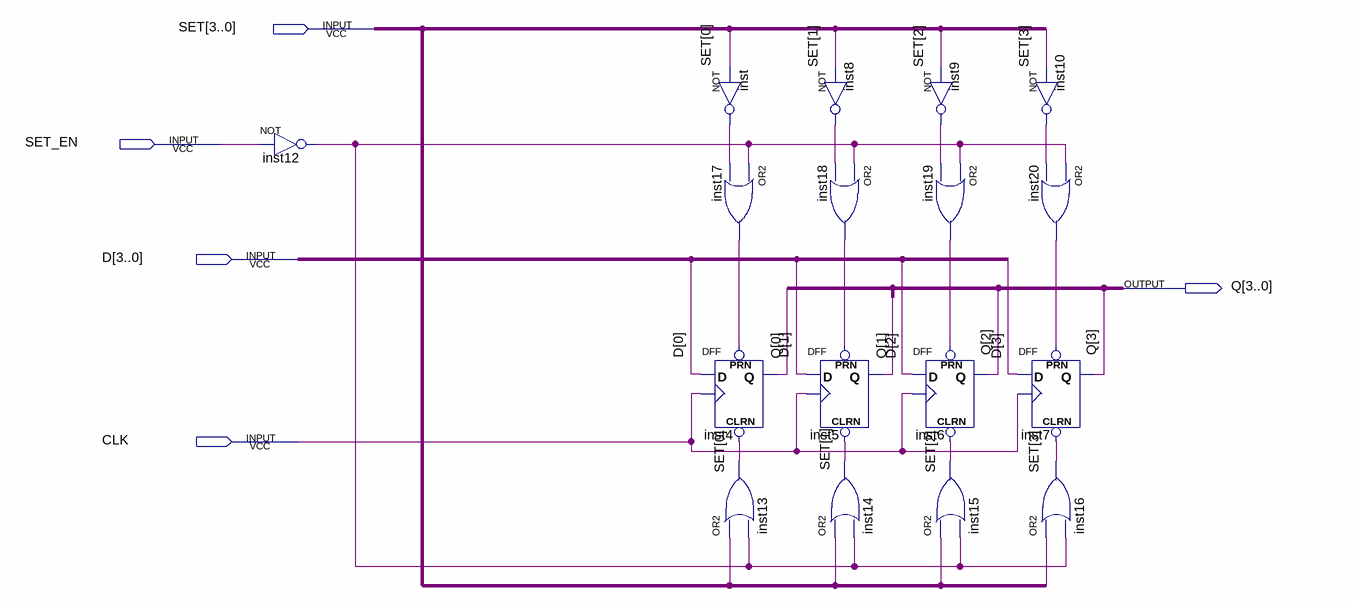
[diagram p0: schematic sheet]
// Quartus schematic 4_bit_register.bdf as structural Verilog: 17 symbols, 5 pins
module \4_bit_register  (
  input  [3:0] SET,
  input  SET_EN,
  input  [3:0] D,
  input  CLK,
  output [3:0] Q
);

  wire inst8_out, inst9_out, inst10_out, inst12_out, inst13_out, inst14_out, inst15_out, inst16_out,
       inst17_out, inst18_out, inst19_out, inst20_out, inst_out;

  not inst12 (inst12_out, SET_EN);
  not inst (inst_out, SET[0]);
  or inst17 (inst17_out, inst12_out, inst_out);
  DFF inst4 (.CLRN(inst13_out), .CLK(CLK), .D(D[0]), .PRN(inst17_out), .Q(Q[0]));
  or inst13 (inst13_out, SET[0], inst12_out);
  not inst8 (inst8_out, SET[1]);
  or inst18 (inst18_out, inst12_out, inst8_out);
  DFF inst5 (.CLRN(inst14_out), .CLK(CLK), .D(D[1]), .PRN(inst18_out), .Q(Q[1]));
  or inst14 (inst14_out, SET[1], inst12_out);
  not inst9 (inst9_out, SET[2]);
  or inst19 (inst19_out, inst12_out, inst9_out);
  DFF inst6 (.CLRN(inst15_out), .CLK(CLK), .D(D[2]), .PRN(inst19_out), .Q(Q[2]));
  or inst15 (inst15_out, SET[2], inst12_out);
  not inst10 (inst10_out, SET[3]);
  or inst20 (inst20_out, inst12_out, inst10_out);
  DFF inst7 (.CLRN(inst16_out), .CLK(CLK), .D(D[3]), .PRN(inst20_out), .Q(Q[3]));
  or inst16 (inst16_out, SET[3], inst12_out);
endmodule
